# Altium schematic sheet STAC_Test_Board_v1_SwitchesButtons.SchDoc: STAC User Switches and Buttons
size B; DrawnBy: Rahul Kumar; Revision: X1; SheetNumber: 5; SheetTotal: 5
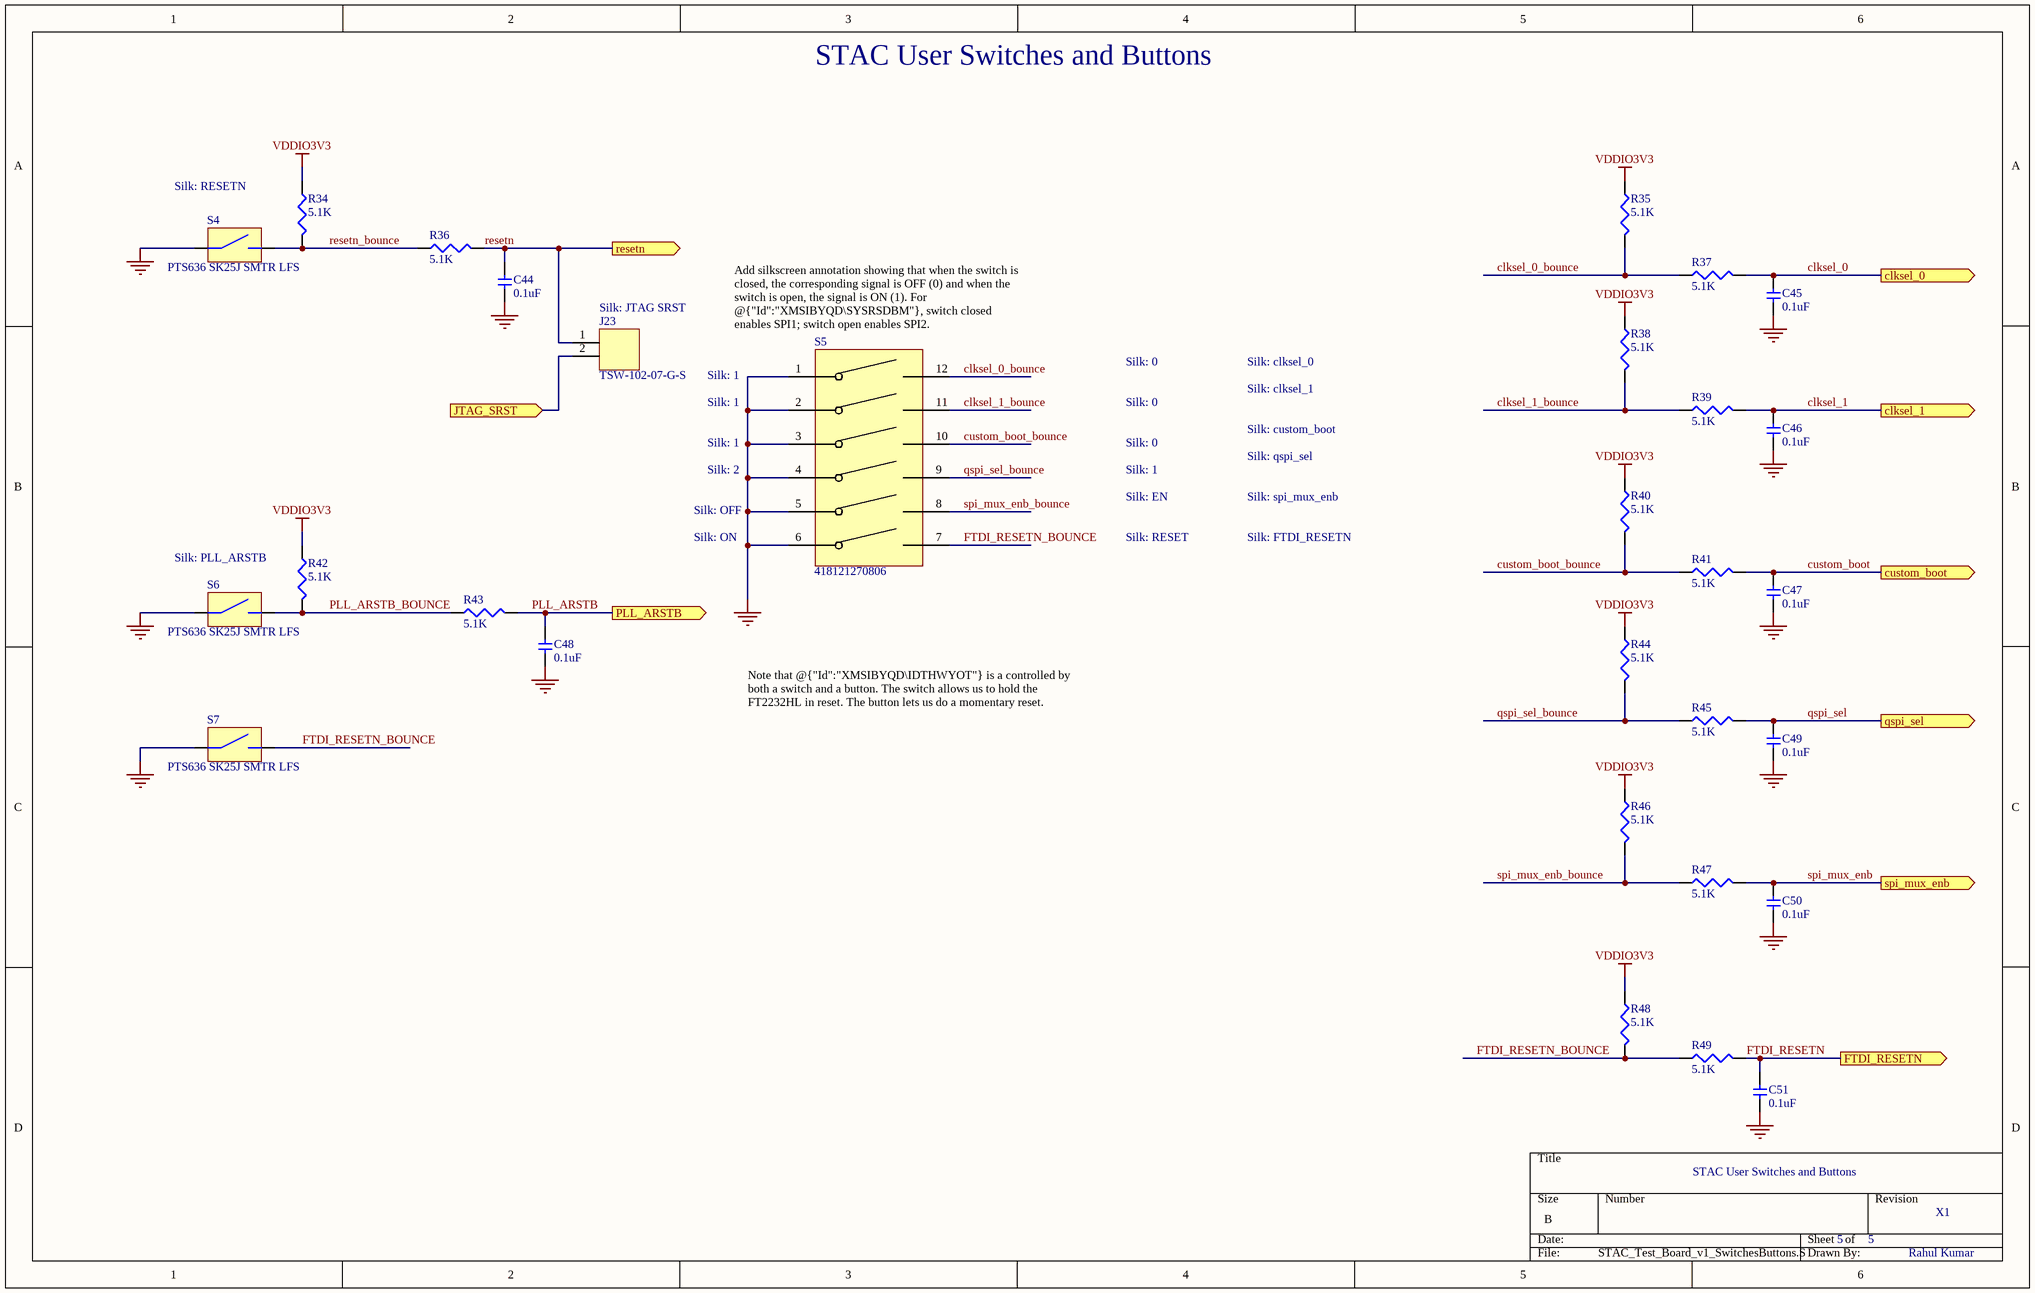
[diagram p0: STAC_Test_Board_v1_SwitchesButtons.SchDoc]

## Parts
C44  0.1uF  [0603]
C45  0.1uF  [0603]
C46  0.1uF  [0603]
C47  0.1uF  [0603]
C48  0.1uF  [0603]
C49  0.1uF  [0603]
C50  0.1uF  [0603]
C51  0.1uF  [0603]
J23  TSW-102-07-G-S  [CON-002-100-200X100/1X2-POST]
R34  5.1K  [0603]
R35  5.1K  [0603]
R36  5.1K  [0603]
R37  5.1K  [0603]
R38  5.1K  [0603]
R39  5.1K  [0603]
R40  5.1K  [0603]
R41  5.1K  [0603]
R42  5.1K  [0603]
R43  5.1K  [0603]
R44  5.1K  [0603]
R45  5.1K  [0603]
R46  5.1K  [0603]
R47  5.1K  [0603]
R48  5.1K  [0603]
R49  5.1K  [0603]
S4  PTS636 SK25J SMTR LFS  [SW-02-6.7X3.7]
S5  418121270806  [GW-12-100-390]
S6  PTS636 SK25J SMTR LFS  [SW-02-6.7X3.7]
S7  PTS636 SK25J SMTR LFS  [SW-02-6.7X3.7]

## Ports
clksel_0 (out, see STAC_Test_Board_v1[3D]), clksel_1 (out, see STAC_Test_Board_v1[3D]), custom_boot (out, see STAC_Test_Board_v1[3D]), FTDI_RESETN (out, see STAC_Test_Board_v1[3D], STAC_Test_Board_v1_USB[4B]), JTAG_SRST (in, see STAC_Test_Board_v1[3D], STAC_Test_Board_v1_USB[5B]), PLL_ARSTB (out, see STAC_Test_Board_v1[3D]), qspi_sel (out, see STAC_Test_Board_v1[3D], STAC_Test_Board_v1_QSPI[3B]), resetn (out, see STAC_Test_Board_v1[3D]), spi_mux_enb (out, see STAC_Test_Board_v1[3D], STAC_Test_Board_v1_QSPI[3B])

## Nets
GND: C44.2 C45.2 C46.2 C47.2 C48.2 C49.2 C50.2 C51.2 S4.2 S5.1 S5.2 S5.3 S5.4 S5.5 S5.6 S6.2 S7.2
VDDIO3V3: R34.1 R35.1 R38.1 R40.1 R42.1 R44.1 R46.1 R48.1
clksel_0: C45.1 R37.2 ; port clksel_0
clksel_0_bounce: R35.2 R37.1 S5.12
clksel_1: C46.1 R39.2 ; port clksel_1
clksel_1_bounce: R38.2 R39.1 S5.11
custom_boot: C47.1 R41.2 ; port custom_boot
custom_boot_bounce: R40.2 R41.1 S5.10
FTDI_RESETN: C51.1 R49.2 ; port FTDI_RESETN
FTDI_RESETN_BOUNCE: R48.2 R49.1 S5.7 S7.1
JTAG_SRST: J23.2 ; port JTAG_SRST
PLL_ARSTB: C48.1 R43.2 ; port PLL_ARSTB
PLL_ARSTB_BOUNCE: R42.2 R43.1 S6.1
qspi_sel: C49.1 R45.2 ; port qspi_sel
qspi_sel_bounce: R44.2 R45.1 S5.9
resetn: C44.1 J23.1 R36.2 ; port resetn
resetn_bounce: R34.2 R36.1 S4.1
spi_mux_enb: C50.1 R47.2 ; port spi_mux_enb
spi_mux_enb_bounce: R46.2 R47.1 S5.8

## Notes on the sheet
- Silk: RESETN
- (near J23) Silk: JTAG SRST
- (near S5) Add silkscreen annotation showing that when the switch is closed, the corresponding signal is OFF (0) and when the switch is open, the signal is ON (1). For @{"Id":"XMSIBYQD\SYSRSDBM"}, switch closed enables SPI1; switch open enables SPI2.
- Silk: 0
- Silk: clksel_0
- Silk: 1
- Silk: clksel_1
- Silk: custom_boot
- Silk: 2
- Silk: EN
- Silk: qspi_sel
- Silk: spi_mux_enb
- Silk: PLL_ARSTB
- Silk: OFF
- Silk: ON
- Silk: RESET
- Silk: FTDI_RESETN
- Note that @{"Id":"XMSIBYQD\IDTHWYOT"} is a controlled by both a switch and a button. The switch allows us to hold the FT2232HL in reset. The button lets us do a momentary reset.

## Library data of the parts
C44-C51 = DISCRETE_C: Capacitor generic
J23 = CON_002pin_1x2: Con 2 pins
R34-R49 = DISCRETE_R: Resistor generic
S4 S6 S7 = SWITCH_SPST_2pin: Switch 2 pins
S5 = SWITCH_SPST_x6: SWITCH DIP SPST x6